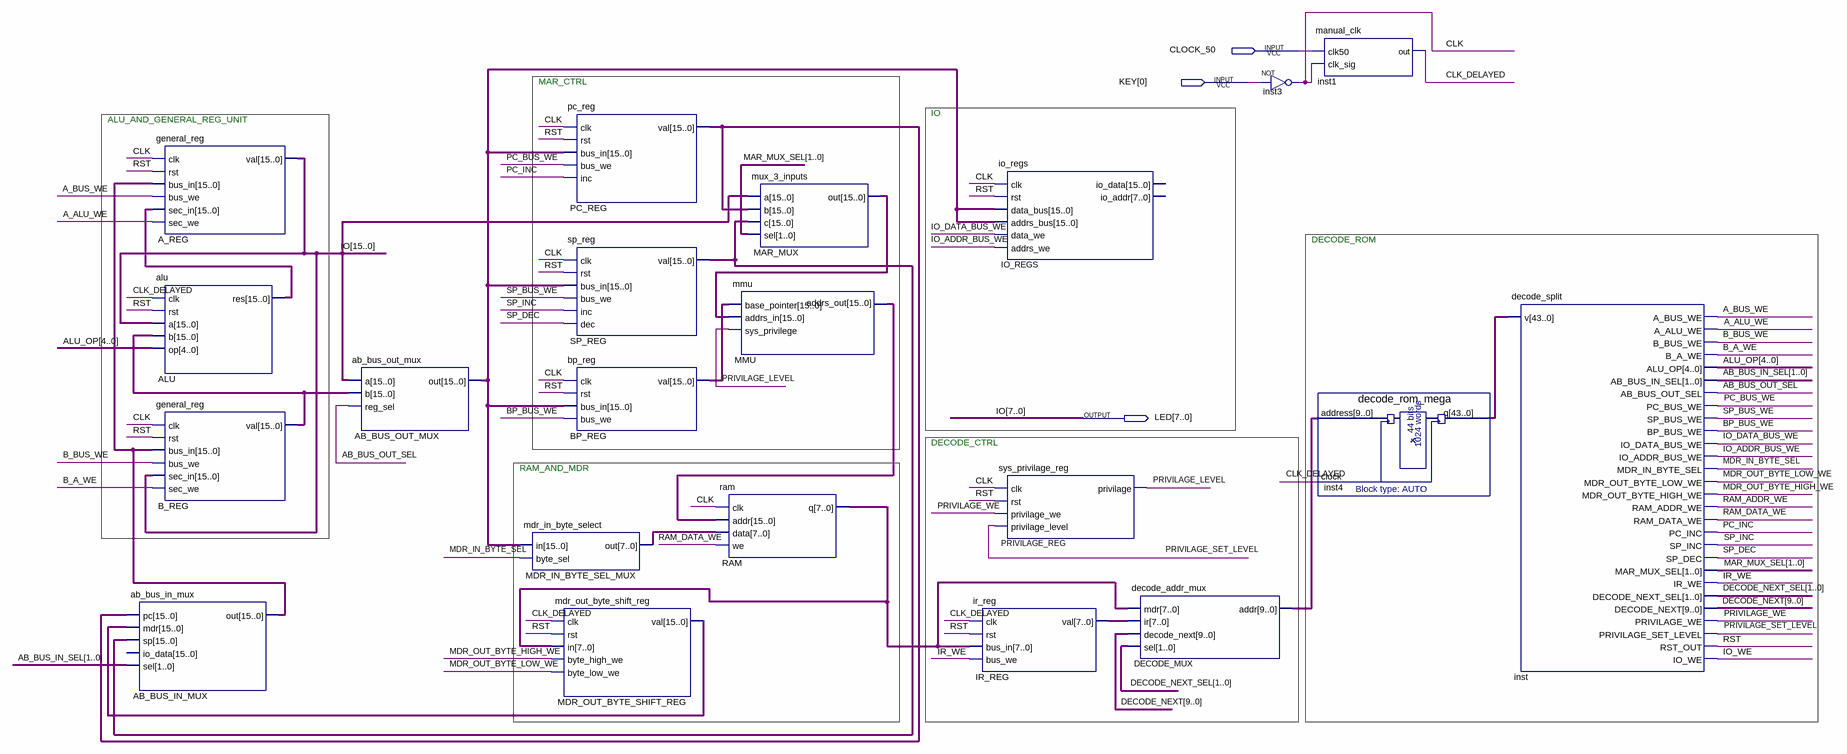
[diagram p0: schematic sheet]
// Quartus schematic old_design.bdf as structural Verilog: 21 symbols, 3 pins
module old_design (
  input  CLOCK_50,
  input  [0:0] KEY,
  output [7:0] LED
);

  wire A_ALU_WE, A_BUS_WE, AB_BUS_OUT_SEL, B_A_WE, B_BUS_WE, BP_BUS_WE, CLK, CLK_DELAYED, IO_ADDR_BUS_WE,
       IO_DATA_BUS_WE, IO_WE, IR_WE, MDR_IN_BYTE_SEL, MDR_OUT_BYTE_HIGH_WE, MDR_OUT_BYTE_LOW_WE, PC_BUS_WE,
       PC_INC, PRIVILAGE_LEVEL, PRIVILAGE_SET_LEVEL, PRIVILAGE_WE, RAM_ADDR_WE, RAM_DATA_WE, RST, SP_BUS_WE,
       SP_DEC, SP_INC;
  wire [1:0] AB_BUS_IN_SEL, DECODE_NEXT_SEL, MAR_MUX_SEL;
  wire [4:0] ALU_OP;
  wire [7:0] IR_REG_val, MDR_IN_BYTE_SEL_MUX_out, RAM_q;
  wire [9:0] DECODE_MUX_addr, DECODE_NEXT;
  wire [15:0] AB_BUS_IN_MUX_out, AB_BUS_OUT_MUX_out, ALU_res, B_REG_val, BP_REG_val, MAR_MUX_out,
       MDR_OUT_BYTE_SHIFT_REG_val, MMU_addrs_out, PC_REG_val, SP_REG_val;
  wire [15:8] IO;
  wire [43:0] inst4_q;

  ab_bus_in_mux AB_BUS_IN_MUX (
    .pc(PC_REG_val), .mdr(MDR_OUT_BYTE_SHIFT_REG_val), .sp(SP_REG_val), .sel(AB_BUS_IN_SEL),
    .out(AB_BUS_IN_MUX_out));  // open: io_data
  general_reg A_REG (
    .clk(CLK), .rst(RST), .bus_in(AB_BUS_IN_MUX_out), .bus_we(A_BUS_WE), .sec_in(ALU_res), .sec_we(A_ALU_WE),
    .val({IO, LED}));
  alu ALU (.clk(CLK_DELAYED), .rst(RST), .a({IO, LED}), .b(B_REG_val), .op(ALU_OP), .res(ALU_res));
  general_reg B_REG (
    .clk(CLK), .rst(RST), .bus_in(AB_BUS_IN_MUX_out), .bus_we(B_BUS_WE), .sec_in({IO, LED}), .sec_we(B_A_WE),
    .val(B_REG_val));
  ab_bus_out_mux AB_BUS_OUT_MUX (.a({IO, LED}), .b(B_REG_val), .reg_sel(AB_BUS_OUT_SEL), .out(AB_BUS_OUT_MUX_out));
  mdr_in_byte_select MDR_IN_BYTE_SEL_MUX (
    .in(AB_BUS_OUT_MUX_out), .byte_sel(MDR_IN_BYTE_SEL), .out(MDR_IN_BYTE_SEL_MUX_out));
  mdr_out_byte_shift_reg MDR_OUT_BYTE_SHIFT_REG (
    .clk(CLK_DELAYED), .rst(RST), .in(RAM_q), .byte_high_we(MDR_OUT_BYTE_HIGH_WE),
    .byte_low_we(MDR_OUT_BYTE_LOW_WE), .val(MDR_OUT_BYTE_SHIFT_REG_val));
  pc_reg PC_REG (.clk(CLK), .rst(RST), .bus_in(AB_BUS_OUT_MUX_out), .bus_we(PC_BUS_WE), .inc(PC_INC), .val(PC_REG_val));
  sp_reg SP_REG (
    .clk(CLK), .rst(RST), .bus_in(AB_BUS_OUT_MUX_out), .bus_we(SP_BUS_WE), .inc(SP_INC), .dec(SP_DEC),
    .val(SP_REG_val));
  bp_reg BP_REG (.clk(CLK), .rst(RST), .bus_in(AB_BUS_OUT_MUX_out), .bus_we(BP_BUS_WE), .val(BP_REG_val));
  mux_3_inputs MAR_MUX (.a({IO, LED}), .b(PC_REG_val), .c(SP_REG_val), .sel(MAR_MUX_SEL), .out(MAR_MUX_out));
  mmu MMU (
    .base_pointer(BP_REG_val), .addrs_in(MAR_MUX_out), .sys_privilege(PRIVILAGE_LEVEL),
    .addrs_out(MMU_addrs_out));
  ram RAM (.clk(CLK), .addr(MMU_addrs_out), .data(MDR_IN_BYTE_SEL_MUX_out), .we(RAM_DATA_WE), .q(RAM_q));
  io_regs IO_REGS (
    .clk(CLK), .rst(RST), .data_bus(AB_BUS_OUT_MUX_out), .addrs_bus(AB_BUS_OUT_MUX_out),
    .data_we(IO_DATA_BUS_WE), .addrs_we(IO_ADDR_BUS_WE));  // open: io_data, io_addr
  sys_privilage_reg PRIVILAGE_REG (
    .clk(CLK), .rst(RST), .privilage_we(PRIVILAGE_WE), .privilage_level(PRIVILAGE_SET_LEVEL),
    .privilage(PRIVILAGE_LEVEL));
  ir_reg IR_REG (.clk(CLK_DELAYED), .rst(RST), .bus_in(RAM_q), .bus_we(IR_WE), .val(IR_REG_val));
  decode_addr_mux DECODE_MUX (
    .mdr(RAM_q), .ir(IR_REG_val), .decode_next(DECODE_NEXT), .sel(DECODE_NEXT_SEL), .addr(DECODE_MUX_addr));
  not inst3 (CLK, KEY[0]);
  manual_clk inst1 (.clk50(CLOCK_50), .clk_sig(CLK), .out(CLK_DELAYED));
  decode_rom_mega inst4 (.address(DECODE_MUX_addr), .clock(CLK_DELAYED), .q(inst4_q));
  decode_split inst (
    .v(inst4_q), .A_BUS_WE(A_BUS_WE), .A_ALU_WE(A_ALU_WE), .B_BUS_WE(B_BUS_WE), .B_A_WE(B_A_WE),
    .ALU_OP(ALU_OP), .AB_BUS_IN_SEL(AB_BUS_IN_SEL), .AB_BUS_OUT_SEL(AB_BUS_OUT_SEL), .PC_BUS_WE(PC_BUS_WE),
    .SP_BUS_WE(SP_BUS_WE), .BP_BUS_WE(BP_BUS_WE), .IO_DATA_BUS_WE(IO_DATA_BUS_WE),
    .IO_ADDR_BUS_WE(IO_ADDR_BUS_WE), .MDR_IN_BYTE_SEL(MDR_IN_BYTE_SEL),
    .MDR_OUT_BYTE_LOW_WE(MDR_OUT_BYTE_LOW_WE), .MDR_OUT_BYTE_HIGH_WE(MDR_OUT_BYTE_HIGH_WE),
    .RAM_ADDR_WE(RAM_ADDR_WE), .RAM_DATA_WE(RAM_DATA_WE), .PC_INC(PC_INC), .SP_INC(SP_INC), .SP_DEC(SP_DEC),
    .MAR_MUX_SEL(MAR_MUX_SEL), .IR_WE(IR_WE), .DECODE_NEXT_SEL(DECODE_NEXT_SEL), .DECODE_NEXT(DECODE_NEXT),
    .PRIVILAGE_WE(PRIVILAGE_WE), .PRIVILAGE_SET_LEVEL(PRIVILAGE_SET_LEVEL), .RST_OUT(RST), .IO_WE(IO_WE));

  // Other names for the same wires on the sheet: IO[7:0] = LED

  // Notes on the sheet:
  //   MAR_CTRL
  //   IO
  //   ALU_AND_GENERAL_REG_UNIT
  //   DECODE_ROM
  //   DECODE_CTRL
  //   RAM_AND_MDR
endmodule
